# EAGLE schematic board (EAGLE 9.6.2)
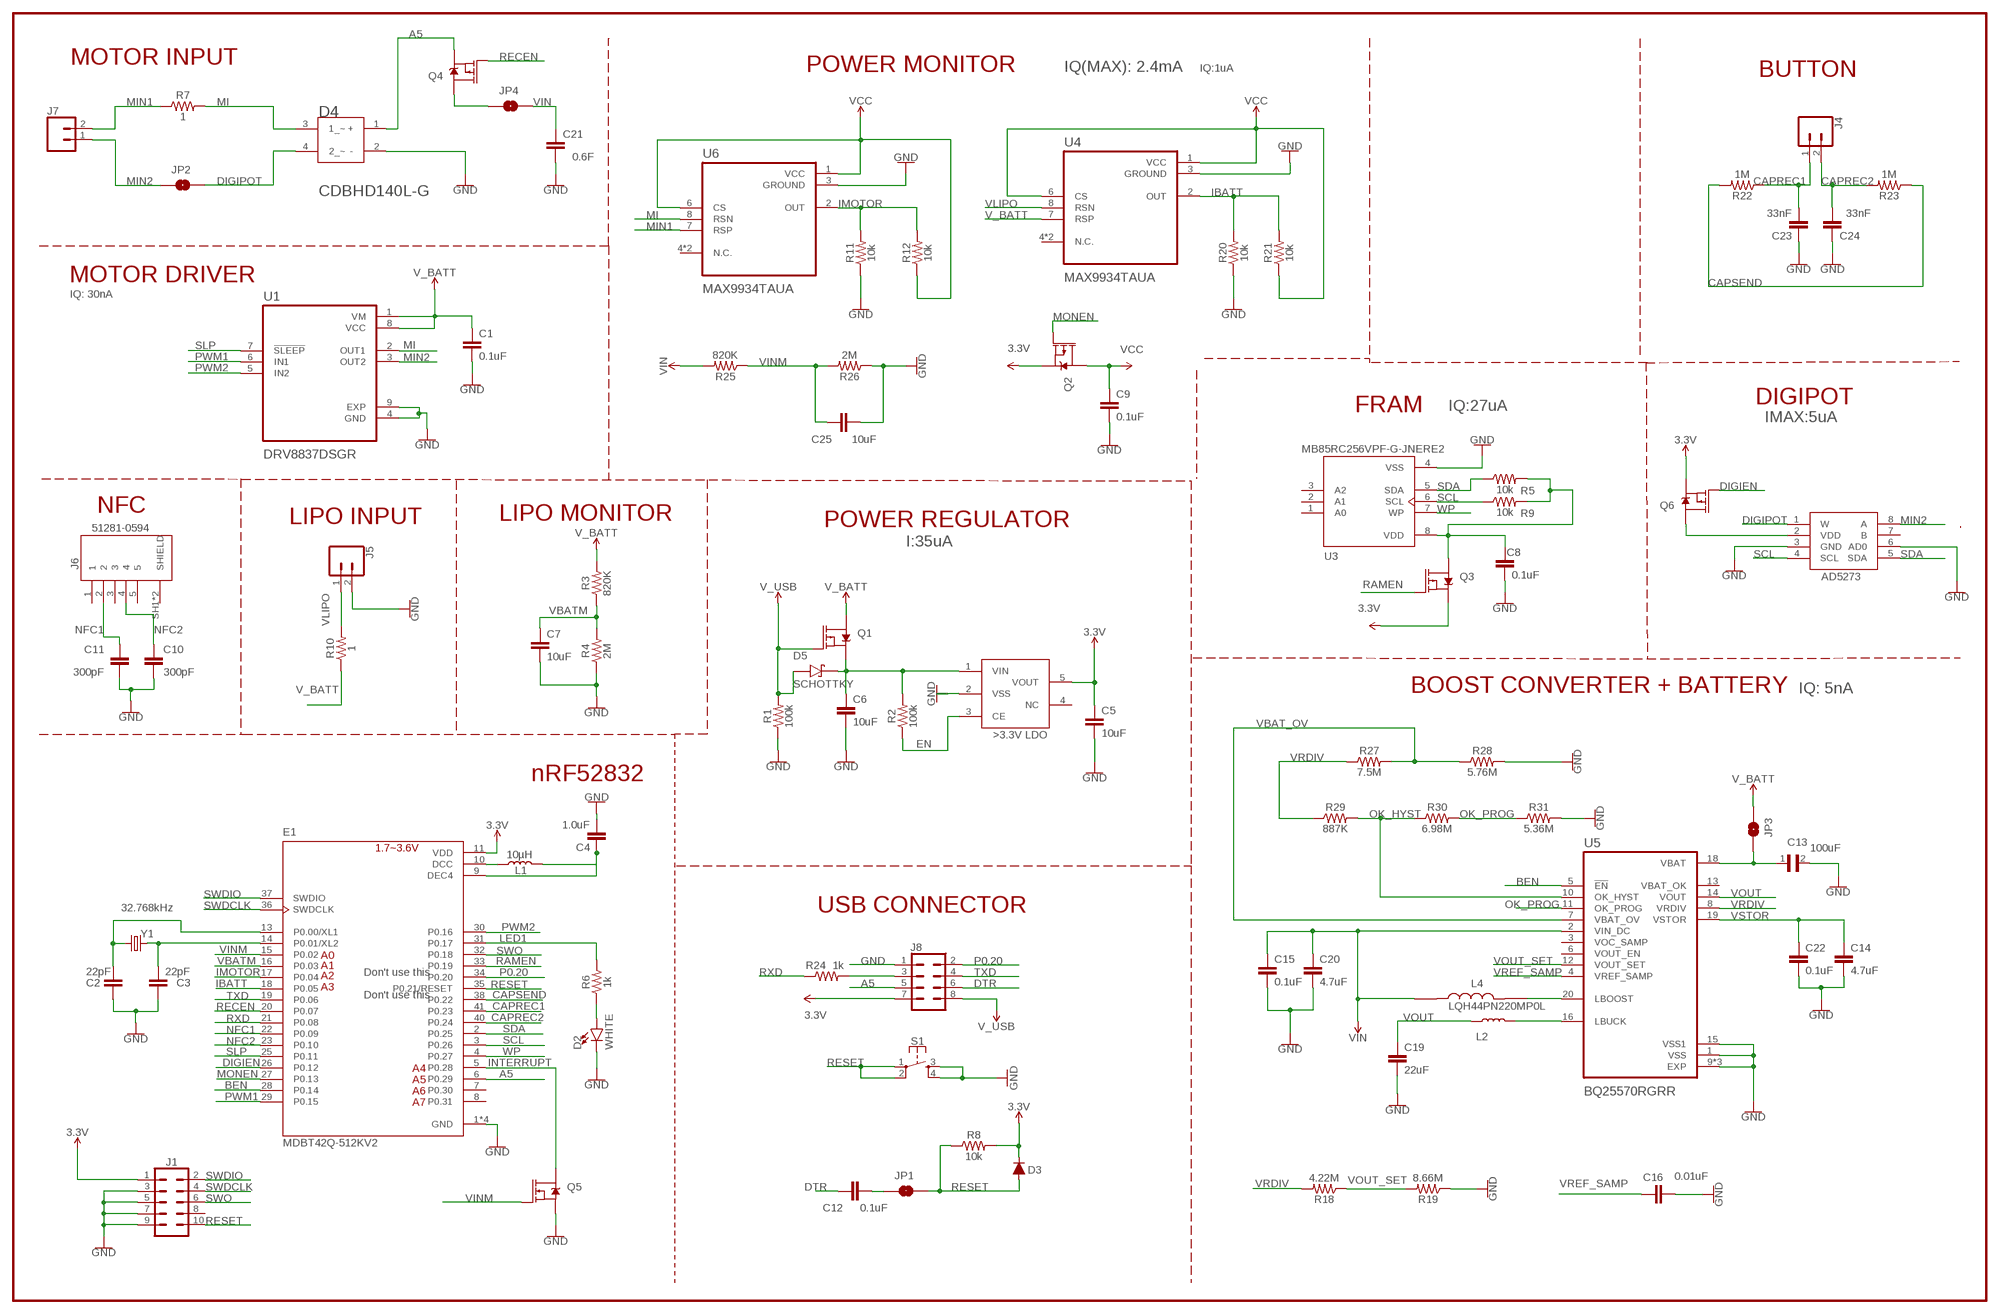
[diagram p0: schematic, sheet 1]

## Parts
C1  0.1uF  0.1UF-0603-25V-(+80/-20%)  [0603]
C2  22pF  22PF-0603-50V-5%  [0603]
C3  22pF  22PF-0603-50V-5%  [0603]
C4  1.0uF  1.0UF-0603-16V-10%  [0603]
C5  10uF  1.0UF-0603-16V-10%  [0603]
C6  10uF  1.0UF-0603-16V-10%  [0603]
C7  10uF  1.0UF-0603-16V-10%  [0603]
C8  0.1uF  0.1UF-0603-25V-(+80/-20%)  [0603]
C9  0.1uF  0.1UF-0603-25V-(+80/-20%)  [0603]
C10  300pF  33NF-0603-50V-10%  [0603]
C11  300pF  33NF-0603-50V-10%  [0603]
C12  0.1uF  0.1UF-0603-25V-(+80/-20%)  [0603]
C13  100uF  LD125C274JAB2A  [CAPC4532X127N]
C14  4.7uF  1.0UF-0805-25V-(+80/-20%)  [0805]
C15  0.1uF  0.1UF-0603-25V-(+80/-20%)  [0603]
C16  0.01uF  0.1UF-0603-25V-(+80/-20%)  [0603]
C19  22uF  0.1UF-0603-25V-(+80/-20%)  [0603]
C20  4.7uF  1.0UF-0805-25V-(+80/-20%)  [0805]
C21  0.6F  2.2UF-0805-25V-(+80/-20%)  [0805]
C22  0.1uF  0.1UF-0603-25V-(+80/-20%)  [0603]
C23  33nF  33NF-0603-50V-10%  [0603]
C24  33nF  33NF-0603-50V-10%  [0603]
C25  10uF  10UF-0603-6.3V-20%  [0603]
D2  WHITE  LED-WHITE0603  [LED-0603]
D3  250mA/100V  DIODE-BAS16J  [SOD-323]
D4  COMCHIP_CDBHD140L-GCOMCHIP_CDBHD140L-G_0_0  [COMCHIP_CDBHD140L-G_0]
D5  SCHOTTKY  1N5819HW-7-F  [SOD3715X145N]
E1  MDBT42Q-512KV2  [RAYTAC_MDBT42Q-512KV2]
J1  CONN_05X2SHD_SMD  [2X5-SHROUDED_SMD]
J4  CONN_02  [1X02]
J5  CONN_02  [1X02]
J6  51281-0594  [MOLEX_51281-0594]
J7  CONN_02  [1X02]
J8  CONN_04X2  [2X4]
JP1  JUMPER-SMT_2_NC_TRACE_SILK  [SMT-JUMPER_2_NC_TRACE_SILK]
JP2  JUMPER-SMT_2_NO_SILK  [SMT-JUMPER_2_NO_SILK]
JP3  JUMPER-SMT_2_NO_SILK  [SMT-JUMPER_2_NO_SILK]
JP4  JUMPER-SMT_2_NO_SILK  [SMT-JUMPER_2_NO_SILK]
L1  10µH  INDUCTOR-0805-3.3UH  [0805]
L2  10uH  INDUCTOR-0805-3.3UH  [0805]
L4  LQH44PN220MP0L  [IND_LQH44PN220MP0L]
Q1  MOSFET_PCH-DMG2307L  [SOT23-3]
Q2  2.5A/30V/105mΩ  MOSFET_PCH-DMG2307L  [SOT23-3]
Q3  2.5A/30V/105mΩ  MOSFET_PCH-DMG2307L  [SOT23-3]
Q4  2.5A/30V/105mΩ  MOSFET_PCH-DMG2307L  [SOT23-3]
Q5  5.8A/30V/35mΩ  MOSFET-NCH-AO3404A  [SOT23-3]
Q6  2.5A/30V/105mΩ  MOSFET_PCH-DMG2307L  [SOT23-3]
R1  100k  100KOHM-0603-1/10W-1%  [0603]
R2  100k  100KOHM-0603-1/10W-1%  [0603]
R3  820K  1MOHM-0603-1/4W-5%  [0603]
R4  2M  1MOHM-0603-1/4W-5%  [0603]
R5  10k  10KOHM-0603-1/10W-1%  [0603]
R6  1k  1KOHM-0603-1/10W-1%  [0603]
R7  1  0.05OHM-0603-1/5W-1%  [0603]
R8  10k  10KOHM-0603-1/10W-1%  [0603]
R9  10k  10KOHM-0603-1/10W-1%  [0603]
R10  1  1OHM-0603-1/10W-1%  [0603]
R11  10k  10KOHM-0603-1/10W-1%  [0603]
R12  10k  10KOHM-0603-1/10W-1%  [0603]
R18  4.22M  100KOHM-0603-1/10W-1%  [0603]
R19  8.66M  100KOHM-0603-1/10W-1%  [0603]
R20  10k  10KOHM-0603-1/10W-1%  [0603]
R21  10k  10KOHM-0603-1/10W-1%  [0603]
R22  1M  1MOHM-0603-1/4W-5%  [0603]
R23  1M  1MOHM-0603-1/4W-5%  [0603]
R24  1k  1KOHM-0603-1/10W-1%  [0603]
R25  820K  820KOHM-0603-1/10W-1%  [0603]
R26  2M  2MOHMS-0603-1/10W-1%  [0603]
R27  7.5M  1KOHM-0603-1/10W-1%  [0603]
R28  5.76M  1KOHM-0603-1/10W-1%  [0603]
R29  887K  1KOHM-0603-1/10W-1%  [0603]
R30  6.98M  1KOHM-0603-1/10W-1%  [0603]
R31  5.36M  1KOHM-0603-1/10W-1%  [0603]
S1  MOMENTARY-SWITCH-SPST-2-SMD-4.6X2.8MM  [TACTILE_SWITCH_SMD_4.6X2.8MM]
U1  DRV8837DSGR  [SON50P200X200X80-9N]
U3  MB85RC256VPF-G-JNERE2  [SOP127P797X210-8N]
U4  MAX9934TAUA  [SOP65P490X110-8N]
U5  BQ25570RGRR  [QFN50P350X350X100-21N]
U6  MAX9934TAUA  [SOP65P490X110-8N]
U$1  IC_X8107AC20MR-GSMD  [IC_XC8107AC20MR-G]
U$2  AD5273  [SOT65P280X145-8N]
Y1  32.768kHz  CRYSTAL-32.768KHZSMD-3.2X1.5  [CRYSTAL-SMD-3.2X1.5MM]

## Nets
3.3V: C5.1 D3.C E1.11(VDD) J1.1 J8.7 Q2.2(S) Q3.2(S) Q6.2(S) R8.2 U$1.5(VOUT)
A5: D4.1(+) E1.6(P0.29) J8.5 Q4.2(S)
BEN: E1.28(P0.14) U5.5(!EN)
CAPREC1: C23.2 E1.41(P0.23) J4.1 R22.1
CAPREC2: C24.2 E1.40(P0.24) J4.2 R23.2
CAPSEND: E1.38(P0.22) R22.2 R23.1
DIGIEN: E1.26(P0.12) Q6.1(G)
DIGIPOT: D4.4(2_~) JP2.2 U$2.1(W)
DTR: C12.1 J8.6
EN: R2.1 U$1.3(CE)
GND: C1.2 C2.1 C3.1 C4.2 C5.2 C6.2 C7.2 C8.2 C9.2 C10.2 C11.2 C13.2 C14.2 C15.2 C16.2 C19.2 C20.2 C21.2 C22.2 C23.1 C24.1 C25.2 D2.C D4.2(-) E1.1(GND) E1.12(GND) E1.24(GND) E1.39(GND) J1.3 J1.5 J1.7 J1.9 J5.2 J8.1 Q5.2(S) R1.1 R4.1 R11.1 R19.1 R20.1 R26.1 R28.2 R31.2 S1.3 S1.4 U1.4(GND) U1.9(EXP) U3.4(VSS) U4.3(GROUND) U5.1(VSS) U5.9(EXP) U5.15(VSS1) U5.17(EXP) U5.21(EXP) U6.3(GROUND) U$1.2(VSS) U$2.3(GND) U$2.6(AD0)
IBATT: E1.18(P0.05) R20.2 R21.2 U4.2(OUT)
IMOTOR: E1.17(P0.04) R11.2 R12.2 U6.2(OUT)
INTERRUPT: E1.5(P0.28) Q5.3(D)
LED1: E1.31(P0.17) R6.2
MI: D4.3(1_~) R7.2 U1.2(OUT1) U6.8(RSN)
MIN1: J7.2 R7.1 U6.7(RSP)
MIN2: J7.1 JP2.1 U1.3(OUT2) U$2.8(A)
MONEN: E1.27(P0.13) Q2.1(G)
N$1: E1.10(DCC) L1.1
N$2: L4.2 U5.20(LBOOST)
N$3: C3.2 E1.14(P0.01/XL2) Y1.P$2
N$4: C4.1 E1.9(DEC4) L1.2
N$6: L2.2 U5.16(LBUCK)
N$7: C12.2 JP1.1
N$8: C6.1 D5.C(K) Q1.2(S) R2.2 U$1.1(VIN)
N$9: Q6.3(D) U$2.2(VDD)
N$10: C13.1 JP3.2 U5.18(VBAT)
N$11: C2.2 E1.13(P0.00/XL1) Y1.P$1
N$12: C8.1 Q3.3(D) R5.2 R9.2 U3.8(VDD)
N$13: JP4.1 Q4.3(D)
N$14: D2.A R6.1
N$15: J8.3 R24.2
NFC1: C11.1 E1.22(P0.09) J6.2
NFC2: C10.1 E1.23(P0.10) J6.4
OK_HYST: R29.2 R30.1 U5.10(OK_HYST)
OK_PROG: R30.2 R31.1 U5.11(OK_PROG)
P0.20: E1.34(P0.20) J8.2
PWM1: E1.29(P0.15) U1.6(IN1)
PWM2: E1.30(P0.16) U1.5(IN2)
RAMEN: E1.33(P0.19) Q3.1(G)
RECEN: E1.20(P0.07) Q4.1(G)
RESET: D3.A E1.35(P0.21/RESET) J1.10 JP1.2 R8.1 S1.1 S1.2
RXD: E1.21(P0.08) R24.1
SCL: E1.3(P0.26) R9.1 U3.6(SCL) U$2.4(SCL)
SDA: E1.2(P0.25) R5.1 U3.5(SDA) U$2.5(SDA)
SLP: E1.25(P0.11) U1.7(!SLEEP)
SWDCLK: E1.36(SWDCLK) J1.4
SWDIO: E1.37(SWDIO) J1.2
SWO: E1.32(P0.18) J1.6
TXD: E1.19(P0.06) J8.4
V_BATT: C1.1 JP3.1 Q1.3(D) R3.2 R10.1 U1.1(VM) U1.8(VCC) U4.7(RSP)
V_USB: D5.A J8.8 Q1.1(G) R1.2
VBAT_OV: R27.2 R28.1 U5.7(VBAT_OV)
VBATM: C7.1 E1.16(P0.03) R3.1 R4.2
VCC: C9.1 Q2.3(D) R12.1 R21.1 U4.1(VCC) U4.6(CS) U6.1(VCC) U6.6(CS)
VIN: C15.1 C20.1 C21.1 JP4.2 L4.1 R25.2 U5.2(VIN_DC)
VINM: C25.1 E1.15(P0.02) Q5.1(G) R25.1 R26.2
VLIPO: J5.1 R10.2 U4.8(RSN)
VOUT: C19.1 L2.1 U5.14(VOUT)
VOUT_SET: R18.1 R19.2 U5.12(VOUT_SET)
VRDIV: R18.2 R27.1 R29.1 U5.8(VRDIV)
VREF_SAMP: C16.1 U5.4(VREF_SAMP)
VSTOR: C14.1 C22.1 U5.19(VSTOR)
WP: E1.4(P0.27) U3.7(WP)
Unconnected: E1.7(P0.30) E1.8(P0.31) J1.8 J6.1 J6.3 J6.5 J6.SH1(SHIELD) J6.SH2(SHIELD) U3.1(A0) U3.2(A1) U3.3(A2) U4.4(N.C.) U4.5(N.C.) U5.3(VOC_SAMP) U5.6(VOUT_EN) U5.13(VBAT_OK) U6.4(N.C.) U6.5(N.C.) U$1.4(NC) U$2.7(B)

## Notes on the sheet
- MOTOR INPUT | BUTTON
- POWER MONITOR | IQ(MAX): 2.4mA | IQ:1uA
- MOTOR DRIVER
- IQ: 30nA
- DIGIPOT
- FRAM | IQ:27uA
- IMAX:5uA
- NFC
- LIPO INPUT | LIPO MONITOR | POWER REGULATOR
- I:35uA
- BOOST CONVERTER + BATTERY
- IQ: 5nA
- nRF52832
- 1.7~3.6V
- USB CONNECTOR
- A0
- A1
- Don't use this
- A2
- A3
- Don't use this
- A4
- A5
- A6
- A7

## Library data of the parts
C1 C8 C9 C12 C15 C22 = SparkFun-Capacitors:0.1UF: 0.1µF ceramic capacitors A capacitor is a passive two-terminal electrical component used to store electrical energy temporarily in an electric field.; PROD_ID: CAP-00810
C2 C3 = SparkFun-Capacitors:22PF: 22pF ceramic capacitors A capacitor is a passive two-terminal electrical component used to store electrical energy temporarily in an electric field.; PROD_ID: CAP-07876
C4 = SparkFun-Capacitors:1.0UF: 1µF ceramic capacitors A capacitor is a passive two-terminal electrical component used to store electrical energy temporarily in an electric field.; PROD_ID: CAP-00868
C5-C7 = SparkFun-Capacitors:1.0UF: 1µF ceramic capacitors A capacitor is a passive two-terminal electrical component used to store electrical energy temporarily in an electric field.; PROD_ID: CAP-00868; VALUE: 1.0uF
C10 C11 = SparkFun-Capacitors:33NF: 33nF ceramic capacitors A capacitor is a passive two-terminal electrical component used to store electrical energy temporarily in an electric field.; PROD_ID: CAP-07887; VALUE: 33nF
C13 = LD125C274JAB2A:LD125C274JAB2A: CAP CER 1UF 50V X7R 1812 Check availability <https://pricing.snapeda.com/parts/LD125C274JAB2A/AVX/view-part?ref=eda>; AVAILABILITY: In Stock; DESCRIPTION: CAP 0.27UF 50VDC X7R 5% SMD 1812; MF: AVX; MP: LD125C274JAB2A; PACKAGE: 1812 AVX; PRICE: None; PURCHASE-URL: https://pricing.snapeda.com/search/part/LD125C274JAB2A/?ref=eda
C14 C20 = SparkFun-Capacitors:1.0UF: 1µF ceramic capacitors A capacitor is a passive two-terminal electrical component used to store electrical energy temporarily in an electric field.; PROD_ID: CAP-11625; VALUE: 1.0uF
C16 C19 = SparkFun-Capacitors:0.1UF: 0.1µF ceramic capacitors A capacitor is a passive two-terminal electrical component used to store electrical energy temporarily in an electric field.; PROD_ID: CAP-00810; VALUE: 0.1uF
C21 = SparkFun-Capacitors:2.2UF: 2.2µF ceramic capacitors A capacitor is a passive two-terminal electrical component used to store electrical energy temporarily in an electric field.; PROD_ID: CAP-11624; VALUE: 2.2uF
C23 C24 = SparkFun-Capacitors:33NF: 33nF ceramic capacitors A capacitor is a passive two-terminal electrical component used to store electrical energy temporarily in an electric field.; PROD_ID: CAP-07887
C25 = SparkFun-Capacitors:10UF: 10.0µF ceramic capacitors A capacitor is a passive two-terminal electrical component used to store electrical energy temporarily in an electric field.; PROD_ID: CAP-11015
D2 = SparkFun-LED:LED-WHITE: White SMD LED Used in manufacturing several products at SparkFun. Packages: 0603 - Bright White SMD 0603 package[Product Link] <http://www.kingbrightusa.com/product.asp?catalog_name=LED&product_id=APT1608QWF/D> 1206 - Bright White SMD1206 package [Product Link] <http://www.kingbrightusa.com/product.asp?catalog_name=LED&product_id=APT3216QWF/D> 3014 - Super Bright SMD 3014 package [Datasheet] <http://www.lumileds.com/uploads/459/DS208-pdf> SparkFun Products: Blackberry Trackballer Breakout <https://www.sparkfun.com/products/13169> Digital SandBox <https://www.sparkfun.com/products/12651>; PROD_ID: DIO-09004
D3 = SparkFun-DiscreteSemi:DIODE: Diode These are standard reverse protection diodes and small signal diodes. SparkFun Products: SparkFun SparkPunk Sound Kit <https://www.sparkfun.com/products/11177> SparkFun ESP8266 Thing <https://www.sparkfun.com/products/13231>; PROD_ID: DIO-09646
D4 = Comchip - CDBHD140L-G:COMCHIP_CDBHD140L-G: Low VF Schottky Bridge Rectifiers; CENTROID_NOT_SPECIFIED: No; CURRENT_-_AVERAGE_RECTIFIED_(IO): 1A; CURRENT_-_REVERSE_LEAKAGE_@_VR: 500µA @ 40V; DATASHEET: http://www.comchiptech.com/cms/UserFiles/CDBHD140L-G%20Thru.%20CDBHD1100L-G%20RevC.PDF; DIGIKEY_DESCRIPTION: DIODE SCHOTTKY 1A 40V TO-269AA; DIGIKEY_PART_NUMBER: 641-1210-1-ND; LEAD_FREE: yes; MANUFACTURER_PRODUCT_PAGE: http://www.comchiptech.com/products_search.php?banner=top2&partnumber1=CDBHD140L-G&link=products_search.php; MF: Comchip; MFG_PACKAGE_IDENT: Mini-DIP; MOUSER_PART_NUMBER: 750-CDBHD140L-G; MPN: CDBHD140L-G; PACKAGE: 4-BESOP; PREFIX: D; ROHS: yes; TEMPERATURE_RANGE_HIGH: +125°C; TEMPERATURE_RANGE_LOW: -55°C; VOLTAGE_-_FORWARD_(VF)_(MAX)_@_IF: 440mV @ 1A; VOLTAGE_-_PEAK_REVERSE_(MAX): 40V
D5 = 1N5819HW-7-F:1N5819HW-7-F: 1N5819HW Series 40 V 1 A Surface Mount Schottky Barrier Rectifier - SOD-123 Check availability <https://pricing.snapeda.com/parts/1N5819HW-7-F/Diodes%20Inc./view-part?ref=eda>; AVAILABILITY: In Stock; DESCRIPTION: Diode Schottky 40 V 1A Surface Mount SOD-123; MF: Diodes Inc.; MP: 1N5819HW-7-F; PACKAGE: SOD-123 Fairchild Semiconductor; PRICE: None; PURCHASE-URL: https://pricing.snapeda.com/search/part/1N5819HW-7-F/?ref=eda
E1 = MDBT42Q-512KV2:MDBT42Q-512KV2: Bluetooth Low Energy Module based on Noridc nRF52832 Check availability <https://pricing.snapeda.com/parts/MDBT42Q-512KV2/Raytac%20Corporation/view-part?ref=eda>; AVAILABILITY: In Stock; DESCRIPTION: 802.15.4, Bluetooth Bluetooth v5.2, Zigbee® Transceiver Module 2.36GHz ~ 2.5GHz Integrated, Chip Surface Mount; MF: Raytac Corporation; MP: MDBT42Q-512KV2; PACKAGE: SMD-41 Raytac Corporation; PRICE: None; PURCHASE-URL: https://pricing.snapeda.com/search/part/MDBT42Q-512KV2/?ref=eda
J1 = SparkFun-Connectors:CONN_05X2: Multi connection point. Often used as Generic Header-pin footprint for 0.1 inch spaced/style header connections For AVR SPI programming port, see special device with nice symbol: "AVR_SPI_PROG_5x2.dev" You can populate with any combo of single row headers, but if you'd like an exact match, check these: 2x5 AVR ICSP Male Header <https://www.sparkfun.com/products/778> (PRT-00778) 2x5 Pin Shrouded Header <https://www.sparkfun.com/products/8506> (PRT-08506) On any of the 0.1 inch spaced packages, you can populate with these: Break Away Headers - Straight <https://www.sparkfun.com/products/116> (PRT-00116) Break Away Male Headers - Right Angle <https://www.sparkfun.com/products/553> (PRT-00553) Female Headers <https://www.sparkfun.com/products/115> (PRT-00115) Break Away Headers - Machine Pin <https://www.sparkfun.com/products/117> (PRT-00117) Break Away Female Headers - Swiss Machine Pin <https://www.sparkfun.com/products/743> (PRT-00743) Special note: the shrouded connector mates well with our 5x2 ribbon cables: 2x5 Pin IDC Ribbon Cable <https://www.sparkfun.com/products/8535> (PRT-08535); PROD_ID: CONN-09508
J4 J5 J7 = SparkFun-Connectors:CONN_02: Multi connection point. Often used as Generic Header-pin footprint for 0.1 inch spaced/style header connections On any of the 0.1 inch spaced packages, you can populate with these: Break Away Headers - Straight <https://www.sparkfun.com/products/116> (PRT-00116) Break Away Male Headers - Right Angle <https://www.sparkfun.com/products/553> (PRT-00553) Female Headers <https://www.sparkfun.com/products/115> (PRT-00115) Break Away Headers - Machine Pin <https://www.sparkfun.com/products/117> (PRT-00117) Break Away Female Headers - Swiss Machine Pin <https://www.sparkfun.com/products/743> (PRT-00743) For SCREWTERMINALS and SPRING TERMINALS visit here: Screw Terimnals on SparkFun.com <https://www.sparkfun.com/search/results?term=Screw+Terminals> (5mm/3.5mm/2.54mm spacing) This device is also useful as a general connection point to wire up your design to another part of your project. Our various solder wires solder well into these plated through hole pads. Hook-Up Wire - Assortment (Stranded, 22 AWG) <https://www.sparkfun.com/products/11375> (PRT-11375) Hook-Up Wire - Assortment (Solid Core, 22 AWG) <https://www.sparkfun.com/products/11367> (PRT-11367) View the entire wire category on our website here <https://www.sparkfun.com/categories/141> Special notes: Molex polarized connector foot print use with: PRT-08233 with associated crimp pins and housings. 2.54_SCREWTERM for use with PRT-10571. 3.5mm Screw Terminal footprints for PRT-08084 5mm Screw Terminal footprints for use with PRT-08432
J6 = 51281-0594:51281-0594: FFC / FPC Board Connector, Surface Mount, Receptacle, 25, Top, Bottom, 0.5 mm Check availability <https://pricing.snapeda.com/parts/51281-0594/Molex/view-part?ref=eda>; AVAILABILITY: In Stock; DESCRIPTION: 5 Position FFC, FPC Connector Contacts, Top and Bottom 0.020 (0.50mm) Surface Mount, Right Angle; MF: Molex; MP: 51281-0594; PACKAGE: None; PRICE: None; PURCHASE-URL: https://pricing.snapeda.com/search/part/51281-0594/?ref=eda
J8 = SparkFun-Connectors:CONN_04X2: Multi connection point. Often used as Generic Header-pin footprint for 0.1 inch spaced/style header connections On any of the 0.1 inch spaced packages, you can populate with these: Break Away Headers - Straight <https://www.sparkfun.com/products/116> (PRT-00116) Break Away Male Headers - Right Angle <https://www.sparkfun.com/products/553> (PRT-00553) Female Headers <https://www.sparkfun.com/products/115> (PRT-00115) Break Away Headers - Machine Pin <https://www.sparkfun.com/products/117> (PRT-00117) Break Away Female Headers - Swiss Machine Pin <https://www.sparkfun.com/products/743> (PRT-00743)
JP1 = SparkFun-Jumpers:JUMPER-SMT_2_NC_TRACE: Normally closed trace jumper This jumper has a trace between two pads so it's normally closed (NC). Use a razor knife to open the connection. For best results follow the IPC guidelines for cutting traces: Cutout at least 0.063 mm (0.005 in). Remove all loose material to clean up the cut area. Seal the cut with an approved epoxy. Reapply solder to reclose the connection.
JP2-JP4 = SparkFun-Jumpers:JUMPER-SMT_2_NO: Normally open jumper This jumper has two pads in close proximity to each other. Apply solder to close the connection. Round pads are easier to solder for beginners, but are a lot larger. SparkFun Product that uses the round pads: SparkFun EL Sequencer <https://www.sparkfun.com/products/12781>
L1 L2 = SparkFun-Coils:INDUCTOR: Inductors Resist changes in electrical current. Basically a coil of wire. SparkFun Products: SparkFun Load Cell Amplifier - HX711 <https://www.sparkfun.com/products/13879> IOIO-OTG - V2.2 <https://www.sparkfun.com/products/13613>; PROD_ID: NDUC-13076; VALUE: 3.3µH/±20%/450mA
L4 = LQH44PN220MP0L:LQH44PN220MP0L: Inductor Power Chip Shielded Wirewound 10uH 20% 1MHz Ferrite 1.17A 192mOhm DCR 1515 T/R Check availability <https://pricing.snapeda.com/parts/LQH44PN220MP0L/Murata/view-part?ref=eda>; AVAILABILITY: In Stock; DESCRIPTION: Inductor with Inductance: 22uH Tol. +/-20%, Package: 1515 (4040); MF: Murata; MP: LQH44PN220MP0L; PACKAGE: NONSTANDARD; PRICE: None; PURCHASE-URL: https://pricing.snapeda.com/search/part/LQH44PN220MP0L/?ref=eda
Q1 = SparkFun-DiscreteSemi:MOSFET_PCH: P-channel MOSFETs Voltage controlled devices that allow control of high current outputs. SparkFun Products: SparkFun ESP32 Thing <https://www.sparkfun.com/products/13907> SparkFun ESP8266 Thing <https://www.sparkfun.com/products/13231>; PROD_ID: TRANS-11308; VALUE: 2.5A/30V/105mΩ
Q2-Q4 Q6 = SparkFun-DiscreteSemi:MOSFET_PCH: P-channel MOSFETs Voltage controlled devices that allow control of high current outputs. SparkFun Products: SparkFun ESP32 Thing <https://www.sparkfun.com/products/13907> SparkFun ESP8266 Thing <https://www.sparkfun.com/products/13231>; PROD_ID: TRANS-11308
Q5 = SparkFun-DiscreteSemi:MOSFET-NCH: N-channel MOSFETs Voltage controlled devices that allow control of high current outputs. SparkFun Products: SparkFun OpenScale <https://www.sparkfun.com/products/13261> SparkFun Digital Sandbox <https://www.sparkfun.com/products/12651> SparkFun Monster Moto Shield <https://www.sparkfun.com/products/10182> SparkFun MOSFET Power Controller <https://www.sparkfun.com/products/11214>; PROD_ID: TRANS-12988
R1 R2 = SparkFun-Resistors:100KOHM: 100kΩ resistor A resistor is a passive two-terminal electrical component that implements electrical resistance as a circuit element. Resistors act to reduce current flow, and, at the same time, act to lower voltage levels within circuits. - Wikipedia; PROD_ID: RES-07828
R3 R4 = SparkFun-Resistors:1MOHM: 1MΩ resistor A resistor is a passive two-terminal electrical component that implements electrical resistance as a circuit element. Resistors act to reduce current flow, and, at the same time, act to lower voltage levels within circuits. - Wikipedia; PROD_ID: RES-07868; VALUE: 1M
R5 R8 R9 R11 R12 R20 R21 = SparkFun-Resistors:10KOHM: 10kΩ resistor A resistor is a passive two-terminal electrical component that implements electrical resistance as a circuit element. Resistors act to reduce current flow, and, at the same time, act to lower voltage levels within circuits. - Wikipedia; PROD_ID: RES-00824
R6 R24 = SparkFun-Resistors:1KOHM: 1kΩ resistor A resistor is a passive two-terminal electrical component that implements electrical resistance as a circuit element. Resistors act to reduce current flow, and, at the same time, act to lower voltage levels within circuits. - Wikipedia; PROD_ID: RES-07856
R7 = SparkFun-Resistors:0.05OHM: 0.05Ω resistor A resistor is a passive two-terminal electrical component that implements electrical resistance as a circuit element. Resistors act to reduce current flow, and, at the same time, act to lower voltage levels within circuits. - Wikipedia; PROD_ID: RES-12535; VALUE: 0.05
R10 = SparkFun-Resistors:1OHM: 1Ω resistor A resistor is a passive two-terminal electrical component that implements electrical resistance as a circuit element. Resistors act to reduce current flow, and, at the same time, act to lower voltage levels within circuits. - Wikipedia; PROD_ID: RES-08269
R18 R19 = SparkFun-Resistors:100KOHM: 100kΩ resistor A resistor is a passive two-terminal electrical component that implements electrical resistance as a circuit element. Resistors act to reduce current flow, and, at the same time, act to lower voltage levels within circuits. - Wikipedia; PROD_ID: RES-07828; VALUE: 100k
R22 R23 = SparkFun-Resistors:1MOHM: 1MΩ resistor A resistor is a passive two-terminal electrical component that implements electrical resistance as a circuit element. Resistors act to reduce current flow, and, at the same time, act to lower voltage levels within circuits. - Wikipedia; PROD_ID: RES-07868
R25 = SparkFun-Resistors:820KOHM: 820kΩ resistor A resistor is a passive two-terminal electrical component that implements electrical resistance as a circuit element. Resistors act to reduce current flow, and, at the same time, act to lower voltage levels within circuits. - Wikipedia; PROD_ID: RES-13247; VALUE: 820k
R26 = SparkFun-Resistors:2MOHMS: 2MΩ resistor A resistor is a passive two-terminal electrical component that implements electrical resistance as a circuit element. Resistors act to reduce current flow, and, at the same time, act to lower voltage levels within circuits. - Wikipedia; PROD_ID: RES-10054; VALUE: 2.0M
R27-R31 = SparkFun-Resistors:1KOHM: 1kΩ resistor A resistor is a passive two-terminal electrical component that implements electrical resistance as a circuit element. Resistors act to reduce current flow, and, at the same time, act to lower voltage levels within circuits. - Wikipedia; PROD_ID: RES-07856; VALUE: 1k
S1 = SparkFun-Switches:MOMENTARY-SWITCH-SPST-2: Momentary Switch (Pushbutton) - SPST - Two Circuits Normally-open (NO) SPST momentary switches (buttons, pushbuttons). Schematic symbol includes two switch circuits. Variants SMD-4.6MMX2.8MM - 4.60mm x 2.80mm Tactile Momentary Button Switch - Used on SparkFun SAMD21 Mini Breakout <https://www.sparkfun.com/products/13664> SMD-5.2MM - Mini Pushbutton Switch - SMD <https://www.sparkfun.com/products/8720> - Used on Arduino Pro Mini <https://www.sparkfun.com/products/11114>; PROD_ID: SWCH-13065
U1 = DRV8837DSGR:DRV8837DSGR: Check availability <https://pricing.snapeda.com/parts/DRV8837DSGR/Texas%20Instruments/view-part?ref=eda>; AVAILABILITY: In Stock; DESCRIPTION: 11-V, 1.8-A H-bridge motor driver 8-WSON -40 to 85; MF: Texas Instruments; MP: DRV8837DSGR; PACKAGE: WSON-8 Texas Instruments; PRICE: None; PURCHASE-URL: https://pricing.snapeda.com/search/part/DRV8837DSGR/?ref=eda
U3 = MB85RC256VPF-G-JNERE2:MB85RC256VPF-G-JNERE2: FRAM (Ferroelectric RAM) Memory IC 256Kb (32K x 8) I2C 1MHz 550ns 8-SOP Check availability <https://pricing.snapeda.com/parts/MB85RC256VPF-G-JNERE2/Fujitsu%20Semiconductor/view-part?ref=eda>; AVAILABILITY: In Stock; MF: Fujitsu Semiconductor; MP: MB85RC256VPF-G-JNERE2; PACKAGE: None; PRICE: None; PURCHASE-URL: https://pricing.snapeda.com/search/part/MB85RC256VPF-G-JNERE2/?ref=eda
U4 U6 = MAX9934TAUA:MAX9934TAUA: Check availability <https://pricing.snapeda.com/parts/MAX9934TAUA%2BT/Maxim%20Integrated/view-part?ref=eda>; AVAILABILITY: In Stock; DESCRIPTION: Current Sense Amplifier 1 Circuit 8-uMAX-EP|8-uSOP-EP; MF: Maxim Integrated; MP: MAX9934TAUA+T; PACKAGE: MICRO MAX-8 Maxim; PRICE: None; PURCHASE-URL: https://pricing.snapeda.com/search/part/MAX9934TAUA+T/?ref=eda
U5 = BQ25570RGRR:BQ25570RGRR: Check availability <https://pricing.snapeda.com/parts/BQ25570RGRR/Texas%20Instruments/view-part?ref=eda>; AVAILABILITY: In Stock; DESCRIPTION: Ultra Low power Harvester power Management IC with boost charger, and Nanopower Buck Converter 20-VQFN -40 to 125; MF: Texas Instruments; MP: BQ25570RGRR; PACKAGE: VQFN-20 Texas Instruments; PRICE: None; PURCHASE-URL: https://pricing.snapeda.com/search/part/BQ25570RGRR/?ref=eda
U$1 = XC6210B332MR:IC_X8107AC20MR-G
U$2 = SOT65P280X145-8N:AD5273
Y1 = SparkFun-Clocks:CRYSTAL-32.768KHZ: 32.768kHz Crystal Frequency: 32.768kHz Frequency Stability: ±20ppm Load Capacitance: 12.5pF (PTH-2X6 & SMD-3.2X1.5), 6pF (SMD-2X6) SparkFun Products: SparkFun BigTime Watch Kit <https://www.sparkfun.com/products/11734> SparkFun nRF52832 Breakout <https://www.sparkfun.com/products/13990> SparkFun Real Time Clock Module <https://www.sparkfun.com/products/12708>; PROD_ID: XTAL-13062